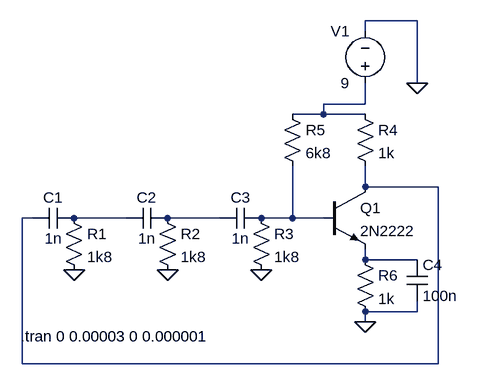
[diagram p0: schematic NPN Phase Shift Oscillator Sim.asc]
NPN Phase Shift Oscillator Sim.asc, the LTspice schematic file:
Version 4
SHEET 1 880 680
WIRE 592 -208 512 -208
WIRE 512 -192 512 -208
WIRE 592 -112 592 -208
WIRE 512 -80 512 -112
WIRE 512 -80 448 -80
WIRE 448 -64 448 -80
WIRE 448 -64 400 -64
WIRE 512 -64 448 -64
WIRE 512 48 512 16
WIRE 624 48 512 48
WIRE 0 96 -16 96
WIRE 144 96 64 96
WIRE 288 96 208 96
WIRE 400 96 400 16
WIRE 400 96 352 96
WIRE 448 96 400 96
WIRE 512 160 512 144
WIRE 592 160 512 160
WIRE 592 240 592 224
WIRE 592 240 512 240
WIRE 512 256 512 240
WIRE -16 320 -16 96
WIRE 624 320 624 48
WIRE 624 320 -16 320
FLAG 64 176 0
FLAG 208 176 0
FLAG 352 176 0
FLAG 592 -112 0
FLAG 512 256 0
SYMBOL cap 64 80 R90
WINDOW 0 0 32 VBottom 2
WINDOW 3 32 32 VTop 2
SYMATTR InstName C1
SYMATTR Value 1n
SYMBOL cap 208 80 R90
WINDOW 0 0 32 VBottom 2
WINDOW 3 32 32 VTop 2
SYMATTR InstName C2
SYMATTR Value 1n
SYMBOL cap 352 80 R90
WINDOW 0 0 32 VBottom 2
WINDOW 3 32 32 VTop 2
SYMATTR InstName C3
SYMATTR Value 1n
SYMBOL res 48 80 R0
SYMATTR InstName R1
SYMATTR Value 1k8
SYMBOL res 192 80 R0
SYMATTR InstName R2
SYMATTR Value 1k8
SYMBOL res 336 80 R0
SYMATTR InstName R3
SYMATTR Value 1k8
SYMBOL res 496 -80 R0
SYMATTR InstName R4
SYMATTR Value 1k
SYMBOL res 384 -80 R0
SYMATTR InstName R5
SYMATTR Value 6k8
SYMBOL voltage 512 -96 R180
WINDOW 0 24 96 Left 2
WINDOW 3 24 16 Left 2
WINDOW 123 0 0 Left 0
WINDOW 39 0 0 Left 0
SYMATTR InstName V1
SYMATTR Value 9
SYMBOL npn 448 48 R0
SYMATTR InstName Q1
SYMATTR Value 2N2222
SYMBOL res 496 144 R0
SYMATTR InstName R6
SYMATTR Value 1k
SYMBOL cap 576 160 R0
SYMATTR InstName C4
SYMATTR Value 100n
TEXT -18 278 Left 2 !.tran 0 0.00003 0 0.000001

The netlist it stands for:
* NPN Phase Shift Oscillator Sim.asc
C1 N003 N002 1n
C2 N004 N003 1n
C3 N005 N004 1n
R1 N003 0 1k8
R2 N004 0 1k8
R3 N005 0 1k8
R4 N001 N002 1k
R5 N001 N005 6k8
V1 N001 0 9
Q1 N002 N005 N006 0 2N2222
R6 N006 0 1k
C4 N006 0 100n
.model NPN NPN
.model PNP PNP
.lib standard.bjt
.tran 0 0.00003 0 0.000001
.backanno
.end